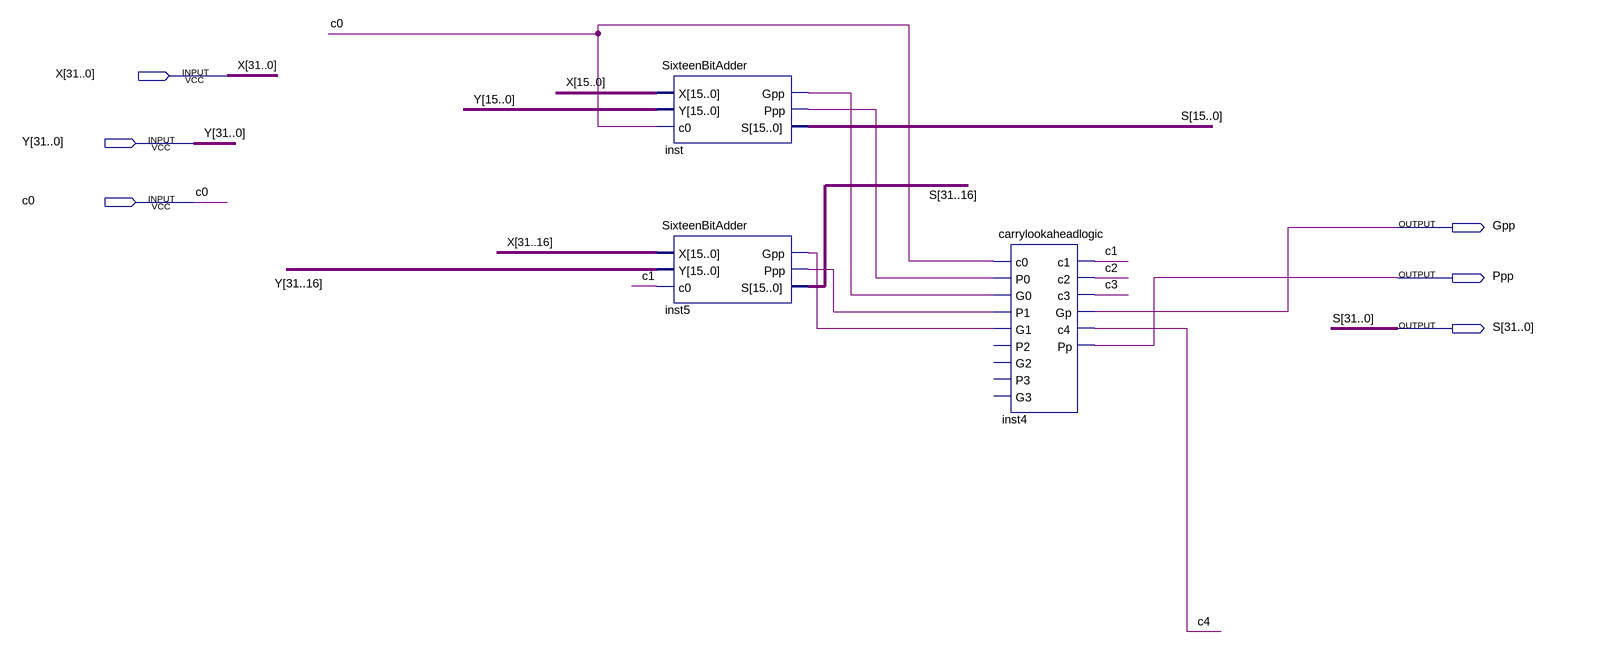
[diagram p0: schematic sheet]
// Quartus schematic ThirtyTwoBitAdder.bdf as structural Verilog: 3 symbols, 6 pins
module ThirtyTwoBitAdder (
  input  [31:0] X,
  input  [31:0] Y,
  input  c0,
  output Gpp,
  output Ppp,
  output [31:0] S
);

  wire c1, c2, c3, c4, inst5_gpp, inst5_ppp, inst_gpp, inst_ppp;

  SixteenBitAdder inst (.X(X[15:0]), .Y(Y[15:0]), .c0(c0), .Gpp(inst_gpp), .Ppp(inst_ppp), .S(S[15:0]));
  SixteenBitAdder inst5 (.X(X[31:16]), .Y(Y[31:16]), .c0(c1), .Gpp(inst5_gpp), .Ppp(inst5_ppp), .S(S[31:16]));
  carrylookaheadlogic inst4 (
    .c0(c0), .P0(inst_ppp), .G0(inst_gpp), .P1(inst5_ppp), .G1(inst5_gpp), .c1(c1), .c2(c2), .c3(c3),
    .Gp(Gpp), .c4(c4), .Pp(Ppp));  // open: P2, G2, P3, G3
endmodule
